# EAGLE design schematics (EAGLE 9.5.1)
Solar LED Lighting
CNAME: Solar LED Lighting; CREVISION: 1.0; DESIGNER: HardwareHacking.blog
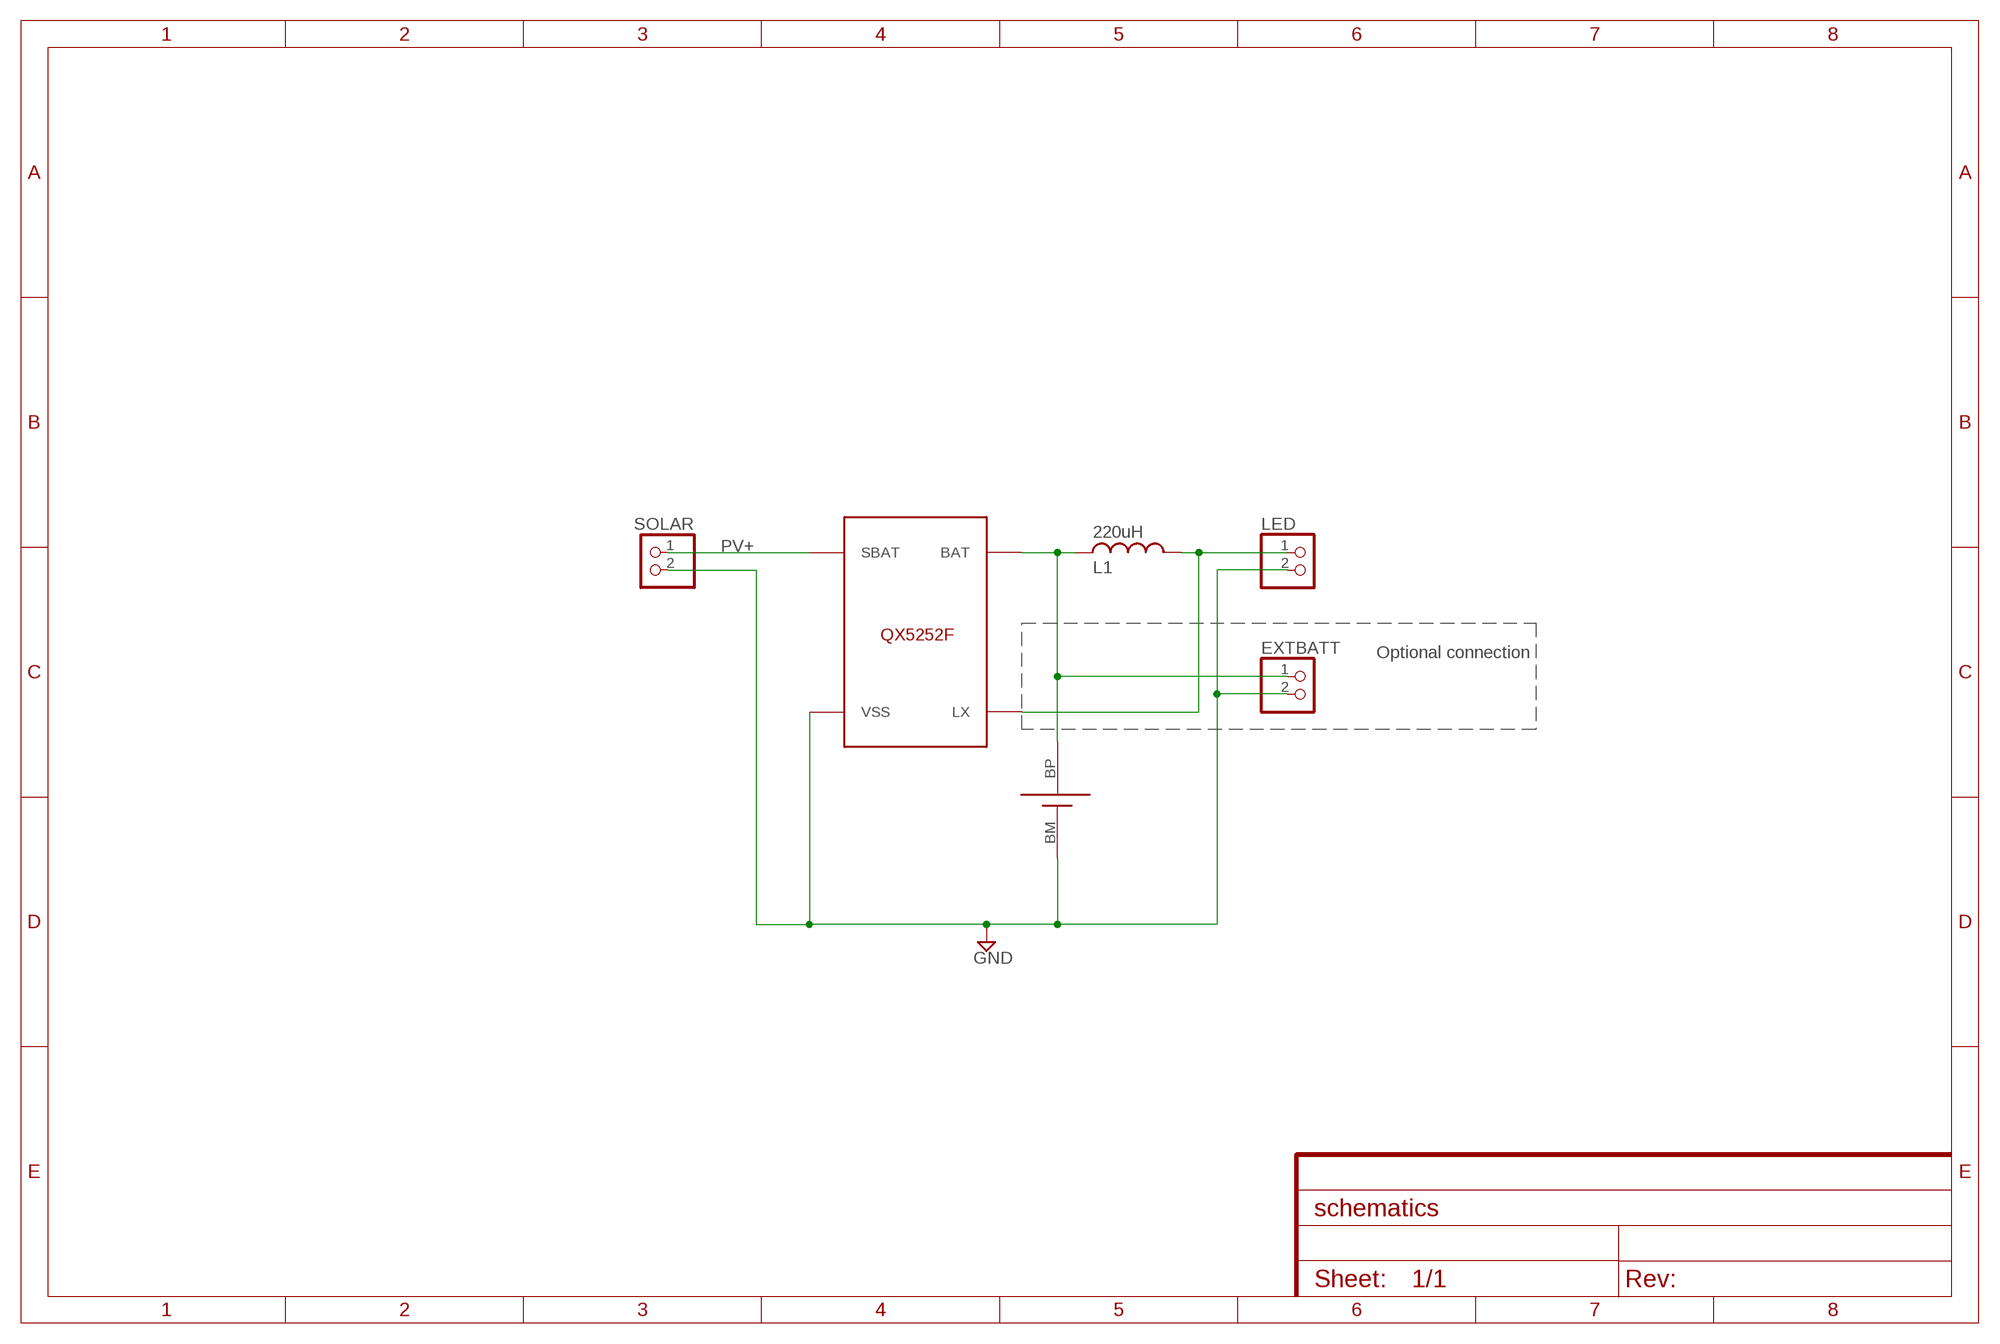
[diagram p0: schematic, sheet 1]

## Parts
EXTBATT  PINHD-1X2  [1X02]
L1  220uH  L-US0204/7  [0204/7]
LED  PINHD-1X2  [1X02]
SOLAR  PINHD-1X2  [1X02]
U$1  QX5252F  [TO-94]
U$2  NIMHCOINBAT  [12VNIMHBAT]

## Nets
B+: EXTBATT.1 L1.2 U$1.BAT U$2.BP(VCC)
GND: EXTBATT.2 LED.2 SOLAR.2 U$1.VSS U$2.BM(GND)
LX: L1.1 LED.1 U$1.LX
PV+: SOLAR.1 U$1.SBAT

## Notes on the sheet
- Optional connection

## Library data of the parts
EXTBATT LED SOLAR = pinhead:PINHD-1X2: PIN HEADER
L1 = rcl:L-US: INDUCTOR, American symbol; SPICEPREFIX: L
U$1 = custom:QX5252F: QX5252F - Solar LED Driver ASIC
U$2 = custom:NIMHCOINBAT: 1.2V 80mAh Ni-MH Coin Cell Battery

## Net classes
0 default: clearance 0.205 mm

## Board
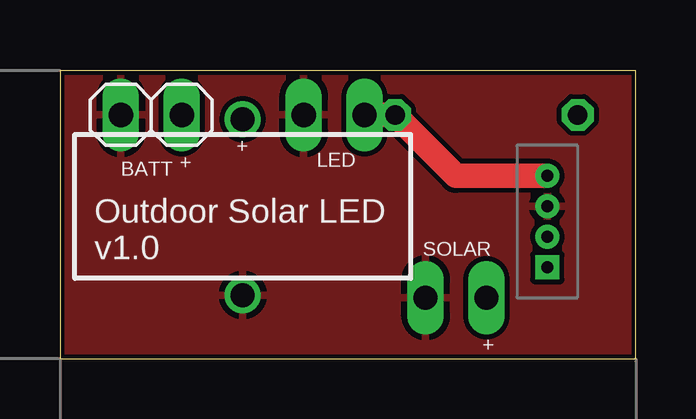
[diagram p1: board, top side]
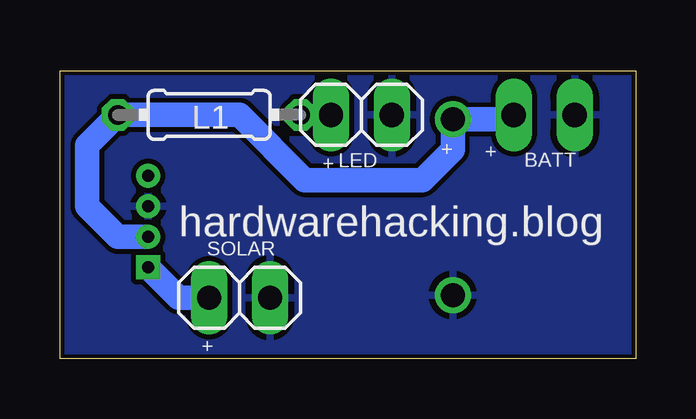
[diagram p2: board, bottom side, seen from below]

Size 24 x 12 mm. Coordinates in mm from the lower left corner, seen from the top.
Outline: 0,0 24,0 24,12 0,12 0,0
Copper layers (1*16): Top 0.035mm / dielectric 1.5mm / Bottom 0.035mm
Design rules "default *": minimum track width 6mil, minimum drill 0.35mm, track to track 6mil, track to pad 6mil, pad to pad 6mil, via to via 6mil, smd to smd 6mil, copper to edge 7mil, drill to drill 6mil, minimum pad ring 10mil, minimum via ring 8mil, stop-mask expansion 4mil, vias tented up to drill 0mil, thermal gap 10mil

### Footprints (pad centres in the part's own frame; a part is rotated, then mirrored left to right if it is on the bottom)
1X02 = drill 1.016 long: 1 -1.27,0; 2 1.27,0
0204/7 = drill 0.813 octagon: 1 -3.81,0; 2 3.81,0
TO-94 = drill 0.5: BAT -1.27,1.27; LX 1.27,1.27; VSS 0,1.27 | drill 0.5 square: SBAT -2.54,1.27
12VNIMHBAT = drill 1: BM 0,-3.7; BP 0,3.632

### Placement (x,y rotation side)
EXTBATT  3.81,10.16 180 top
L1  17.78,10.16 180 bottom
LED  11.43,10.16 0 bottom
SOLAR  16.51,2.54 0 bottom
U$1  21.59,6.35 90 top
U$2  7.62,6.35 0 top

### Tracks (layer width: path | path; a pad name or v marks a point on that pad's centre or on a via)
B+
  Bottom 1.016: U$1.BAT 21.59,5.08 22.86,6.35 22.86,8.89 L1.2 16.51,10.16 13.79,7.44 8.89,7.44 7.62,8.71 U$2.BP 5.26,9.98 EXTBATT.1
GND
  pour Top: -1.27,13.97 26.67,13.97 26.67,-2.54 -1.27,-2.54
  pour Bottom: -1.27,12.7 25.4,12.7 25.4,-1.27 -1.27,-1.27
LX
  Top 1.016: U$1.LX 16.51,7.62 L1.1 LED.1
PV+
  Bottom 1.016: SOLAR.1 19.05,2.54 U$1.SBAT

### Text on the board
tNames: + | BATT | + | LED | Outdoor Solar LED / v1.0 | SOLAR | +
bNames: + | + | BATT | + | hardwarehacking.blog | +